# EAGLE design OneInchRound (EAGLE 7.1.0)
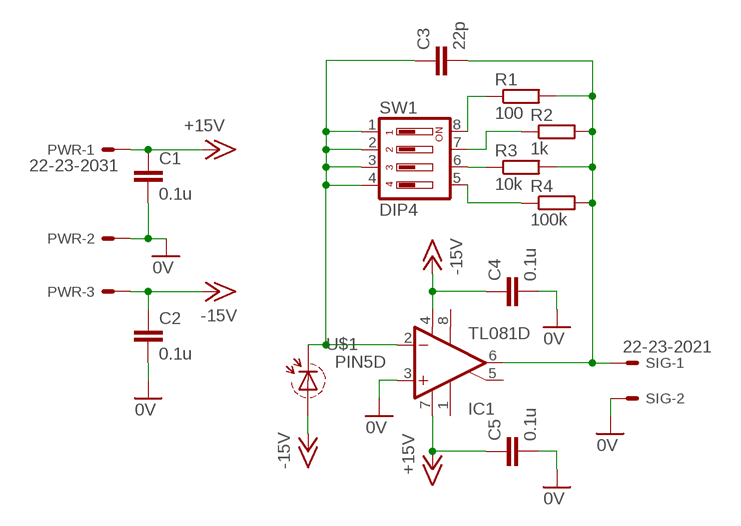
[diagram p0: schematic, sheet 1]

## Parts
C1  0.1u  C-EUC0805  [C0805]
C2  0.1u  C-EUC0805  [C0805]
C3  22p  C-EUC0805  [C0805]
C4  0.1u  C-EUC0805  [C0805]
C5  0.1u  C-EUC0805  [C0805]
IC1  TL081D  [SO08]
PWR  22-23-2031  [22-23-2031]
R1  100  R-EU_R0805  [R0805]
R2  1k  R-EU_R0805  [R0805]
R3  10k  R-EU_R0805  [R0805]
R4  100k  R-EU_R0805  [R0805]
SIG  22-23-2021  [22-23-2021]
SW1  DIP4  [SO08]
U$1  PIN5D  [TO5_2P]

## Nets
0V: C1.2 C2.2 C4.2 C5.2 IC1.3(+IN) PWR.2 SIG.2
+15V: C1.1 C5.1 IC1.7(V+) PWR.1
-15V: C2.1 C4.1 IC1.4(V-) PWR.3 U$1.1(ANODE)
N$1: C3.1 IC1.2(-IN) SW1.1 SW1.2 SW1.3 SW1.4 U$1.3(CATH)
N$2: C3.2 IC1.6(OUT) R1.2 R2.2 R3.2 R4.2 SIG.1
N$3: R3.1 SW1.6
N$4: R4.1 SW1.5
N$5: R2.1 SW1.7
N$6: R1.1 SW1.8
Unconnected: IC1.1(ON1) IC1.5(ON2) IC1.8(OPT)

## Library data of the parts
C1-C5 = rcl:C-EU: CAPACITOR, European symbol
IC1 = linear:TL081: OP AMP
PWR = con-molex:22-23-2031: .100" (2.54mm) Center Header - 3 Pin; MF: MOLEX; MPN: 22-23-2031; OC_FARNELL: 1462950; OC_NEWARK: 30C0862
R1-R4 = rcl:R-EU_: RESISTOR, European symbol
SIG = con-molex:22-23-2021: .100" (2.54mm) Center Header - 2 Pin; MF: MOLEX; MPN: 22-23-2021; OC_FARNELL: 1462926; OC_NEWARK: 25C3832
SW1 = custom_parts:DIP4: DIP4 switch with 0.050 pitch smd package Farnell: 1605479
U$1 = custom_parts:PIN5D: OSI PIN5DP photodiode

## Board
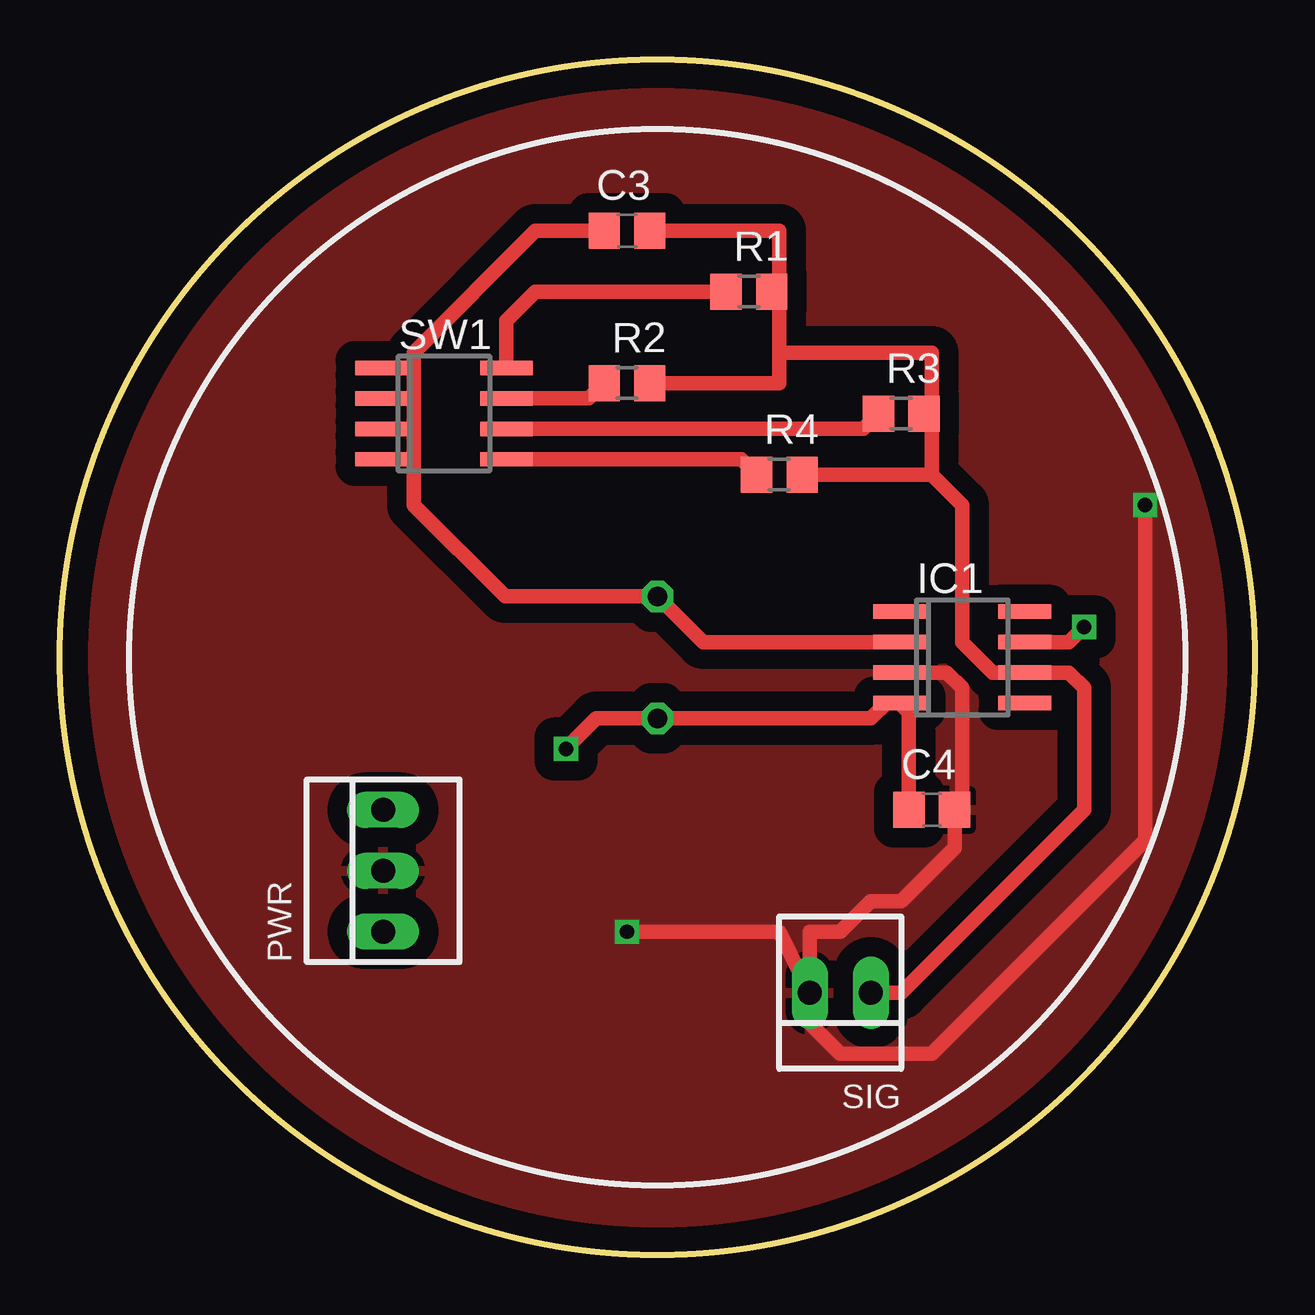
[diagram p1: board, top side]
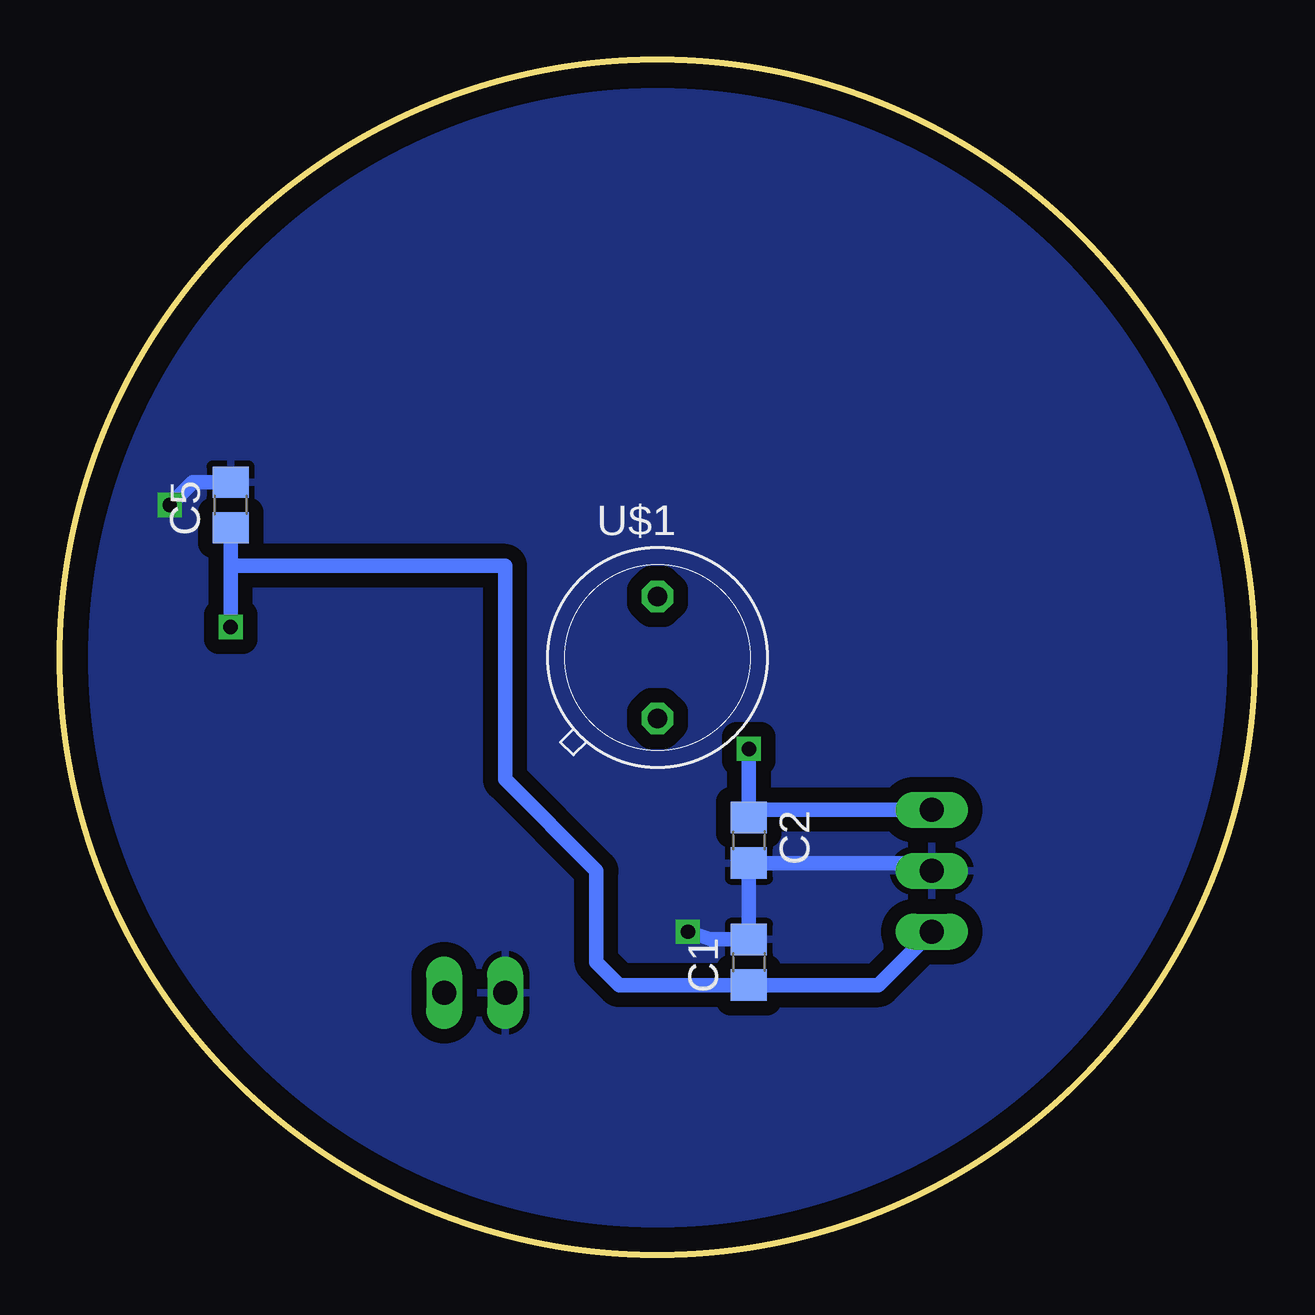
[diagram p2: board, bottom side, seen from below]

Size 49.78 x 49.78 mm. Coordinates in mm from the lower left corner, seen from the top.
Outline: circle at 24.89,24.89 radius 24.89
Copper layers (1*16): Top 0.035mm / dielectric 1.5mm / Bottom 0.035mm
Design rules "default": minimum track width 10mil, minimum drill 24mil, track to track 8mil, track to pad 8mil, pad to pad 8mil, via to via 8mil, smd to smd 8mil, copper to edge 40mil, drill to drill 8mil, minimum pad ring 10mil, minimum via ring 8mil, stop-mask expansion 4mil, vias tented up to drill 0mil, thermal gap 10mil

### Footprints (pad centres in the part's own frame; a part is rotated, then mirrored left to right if it is on the bottom)
C0805 = smd 1.3 x 1.5: 1 -0.95,0; 2 0.95,0
SO08 = smd 0.6 x 2.2: 1 -1.905,-2.6; 2 -0.635,-2.6; 3 0.635,-2.6; 4 1.905,-2.6; 5 1.905,2.6; 6 0.635,2.6; 7 -0.635,2.6; 8 -1.905,2.6
22-23-2031 = drill 1 long: 1 -2.54,0; 2 0,0; 3 2.54,0
R0805 = smd 1.3 x 1.5: 1 -0.95,0; 2 0.95,0
22-23-2021 = drill 1 long: 1 -1.27,0; 2 1.27,0
TO5_2P = drill 0.813 octagon: 1 0,-2.54; 3 0,2.54

### Placement (x,y rotation side)
C1  21.08,12.19 90 bottom
C2  21.08,17.27 270 bottom
C3  23.62,42.67 0 top
C4  36.32,18.54 0 top
C5  42.67,31.24 90 bottom
IC1  37.59,24.89 270 top
PWR  13.46,16 90 top
R1  28.7,40.13 0 top
R2  23.62,36.32 0 top
R3  35.05,35.05 0 top
R4  29.97,32.51 0 top
SIG  32.51,10.92 180 top
SW1  16,35.05 270 top
U$1  24.89,24.89 0 bottom

### Tracks (layer width: path | path; a pad name or v marks a point on that pad's centre or on a via)
0V  (via drill 0.6)
  Top 0.61: v23.62,13.46 29.97,13.46 SIG.2 | v45.21,31.24 45.21,17.27 36.32,8.38 32.51,8.38 31.24,9.65 SIG.2 | SIG.2 31.24,13.46 32.51,13.46 33.78,14.73 35.05,14.73 37.27,16.95 C4.2 37.59,18.86 37.59,23.62 36.96,24.26 IC1.3
  Bottom 0.61: PWR.2 13.78,16.32 C2.2 C1.2 22.67,13.14 v23.62,13.46 | C5.2 44.26,32.19 v45.21,31.24
  pour Top (isolate 0.813): 0.76,26.16 arc-90 24.89,49.02 26.16,49.02 arc-90 49.02,24.89 arc-90 24.89,0.76 arc-90 0.76,24.89
  pour Bottom (isolate 0.61): 0.76,24.89 arc-90 24.89,49.02 26.16,49.02 arc-90 49.02,24.89 arc-90 24.89,0.76 arc-90
+15V  (via drill 0.6)
  Top 0.61: IC1.7 42.04,25.53 v42.67,26.16
  Bottom 0.61: v42.67,26.16 42.67,28.7 | 42.67,28.7 C5.1 | PWR.1 15.68,11.24 C1.1 26.48,11.24 27.43,12.19 27.43,16 31.24,19.81 31.24,28.7 42.67,28.7
-15V  (via drill 0.6)
  Top 0.61: 35.05,22.93 IC1.4 | IC1.4 34.42,22.99 33.78,22.35 U$1.1 22.35,22.35 v21.08,21.08 | C4.1 35.37,22.61 IC1.4
  Bottom 0.61: PWR.3 20.76,18.54 C2.1 v21.08,21.08
N$1
  Top 0.61: IC1.2 26.8,25.53 U$1.3 18.54,27.43 14.73,31.24 14.73,33.15 | 14.73,33.15 SW1.4 | SW1.3 14.73,34.42 | 14.73,34.42 14.73,33.15 | SW1.2 14.73,35.69 | 14.73,35.69 14.73,34.42 | SW1.1 14.73,36.96 | 14.73,36.96 14.73,35.69 | C3.1 19.81,42.67 14.73,37.59 14.73,36.96
N$2
  Top 0.61: SIG.1 35.05,10.92 42.67,18.54 42.67,23.62 42.04,24.26 IC1.6 38.86,24.26 37.59,25.53 37.59,31.24 36.32,32.51 | C3.2 29.97,42.67 29.97,40.45 R1.2 29.97,39.81 29.97,37.59 | R2.2 29.97,36.32 29.97,37.59 | R4.2 36.32,32.51 | 36.32,32.51 36.32,34.73 R3.2 36.32,35.37 36.32,37.59 29.97,37.59
N$3
  Top 0.61: SW1.6 33.47,34.42 R3.1
N$4
  Top 0.61: SW1.5 28.39,33.15 R4.1
N$5
  Top 0.61: SW1.7 22.04,35.69 R2.1
N$6
  Top 0.61: SW1.8 18.6,38.92 19.81,40.13 R1.1